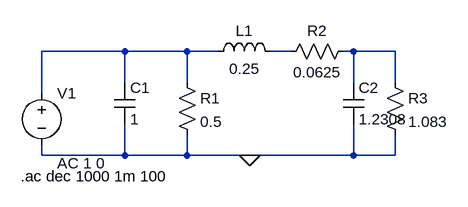
[diagram p0: schematic ej2.asc]
ej2.asc, the LTspice schematic file:
Version 4
SHEET 1 880 680
WIRE 144 80 16 80
WIRE 240 80 144 80
WIRE 288 80 240 80
WIRE 400 80 368 80
WIRE 496 80 480 80
WIRE 560 80 496 80
WIRE 144 128 144 80
WIRE 240 128 240 80
WIRE 496 128 496 80
WIRE 560 128 560 80
WIRE 16 144 16 80
WIRE 16 240 16 224
WIRE 144 240 144 192
WIRE 144 240 16 240
WIRE 240 240 240 208
WIRE 240 240 144 240
WIRE 336 240 240 240
WIRE 496 240 496 192
WIRE 496 240 336 240
WIRE 560 240 560 208
WIRE 560 240 496 240
FLAG 336 240 0
SYMBOL voltage 16 128 R0
WINDOW 123 24 124 Left 2
WINDOW 39 0 0 Left 0
SYMATTR Value2 AC 1 0
SYMATTR InstName V1
SYMATTR Value ""
SYMBOL cap 128 128 R0
SYMATTR InstName C1
SYMATTR Value 1
SYMBOL res 224 112 R0
SYMATTR InstName R1
SYMATTR Value 0.5
SYMBOL res 496 64 R90
WINDOW 0 0 56 VBottom 2
WINDOW 3 32 56 VTop 2
SYMATTR InstName R2
SYMATTR Value 0.0625
SYMBOL ind 272 96 R270
WINDOW 0 32 56 VTop 2
WINDOW 3 5 56 VBottom 2
SYMATTR InstName L1
SYMATTR Value 0.25
SYMBOL res 544 112 R0
SYMATTR InstName R3
SYMATTR Value 1.083
SYMBOL cap 480 128 R0
SYMATTR InstName C2
SYMATTR Value 1.2308
TEXT -16 272 Left 2 !.ac dec 1000 1m 100

The netlist it stands for:
* ej2.asc
V1 N001 0 AC 1 0
C1 N001 0 1
R1 N001 0 0.5
R2 N003 N002 0.0625
L1 N001 N002 0.25
R3 N003 0 1.083
C2 N003 0 1.2308
.ac dec 1000 1m 100
.backanno
.end